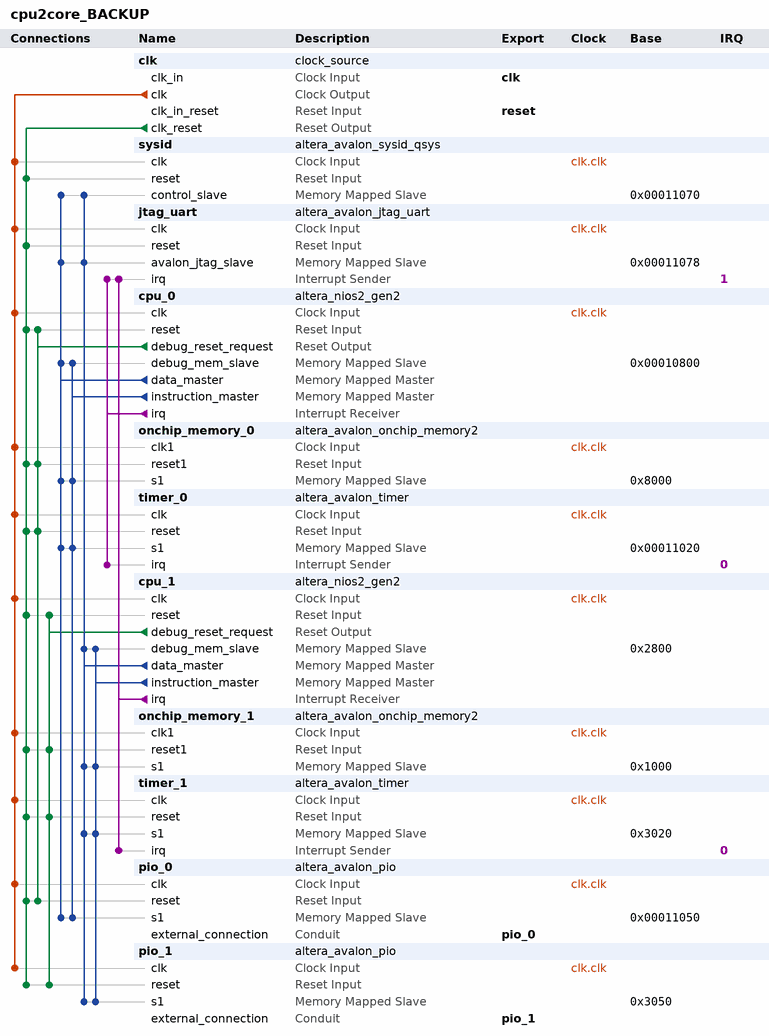
[diagram p0: system contents]
# Platform Designer (Qsys) system cpu2core_BACKUP, MAX 10 10M08SAE144C8GES
# Parameters at their usual value, and those the tool derives, are not listed.
package require -exact qsys 14.1
create_system cpu2core_BACKUP
set_project_property DEVICE_FAMILY {MAX 10}
set_project_property DEVICE 10M08SAE144C8GES

add_instance clk clock_source 14.1
set_instance_parameter_value clk clockFrequency 50000000

add_instance sysid altera_avalon_sysid_qsys 14.1
set_instance_parameter_value sysid id 0

add_instance jtag_uart altera_avalon_jtag_uart 14.1
set_instance_parameter_value jtag_uart simInteractiveOptions NO_INTERACTIVE_WINDOWS

add_instance cpu_0 altera_nios2_gen2 14.1
set_instance_parameter_value cpu_0 dcache_size 2048
set_instance_parameter_value cpu_0 exceptionSlave onchip_memory_0.s1
set_instance_parameter_value cpu_0 icache_size 4096
set_instance_parameter_value cpu_0 impl Tiny
set_instance_parameter_value cpu_0 resetSlave onchip_memory_0.s1

add_instance onchip_memory_0 altera_avalon_onchip_memory2 14.1
set_instance_parameter_value onchip_memory_0 dataWidth 32
set_instance_parameter_value onchip_memory_0 dualPort false
set_instance_parameter_value onchip_memory_0 initMemContent true
set_instance_parameter_value onchip_memory_0 initializationFileName onchip_mem.hex
set_instance_parameter_value onchip_memory_0 memorySize 25600

add_instance timer_0 altera_avalon_timer 14.1
set_instance_parameter_value timer_0 alwaysRun true
set_instance_parameter_value timer_0 fixedPeriod true
set_instance_parameter_value timer_0 period 1
set_instance_parameter_value timer_0 periodUnits USEC
set_instance_parameter_value timer_0 snapshot false

add_instance cpu_1 altera_nios2_gen2 14.1
set_instance_parameter_value cpu_1 dcache_size 2048
set_instance_parameter_value cpu_1 exceptionSlave onchip_memory_1.s1
set_instance_parameter_value cpu_1 icache_size 4096
set_instance_parameter_value cpu_1 impl Tiny
set_instance_parameter_value cpu_1 resetSlave onchip_memory_1.s1

add_instance onchip_memory_1 altera_avalon_onchip_memory2 14.1
set_instance_parameter_value onchip_memory_1 dataWidth 32
set_instance_parameter_value onchip_memory_1 dualPort false
set_instance_parameter_value onchip_memory_1 initMemContent true
set_instance_parameter_value onchip_memory_1 initializationFileName onchip_mem.hex
set_instance_parameter_value onchip_memory_1 memorySize 4096

add_instance timer_1 altera_avalon_timer 14.1
set_instance_parameter_value timer_1 alwaysRun true
set_instance_parameter_value timer_1 fixedPeriod true
set_instance_parameter_value timer_1 period 1
set_instance_parameter_value timer_1 periodUnits USEC
set_instance_parameter_value timer_1 snapshot false

add_instance pio_0 altera_avalon_pio 14.1
set_instance_parameter_value pio_0 direction Output
set_instance_parameter_value pio_0 width 1

add_instance pio_1 altera_avalon_pio 14.1
set_instance_parameter_value pio_1 direction Output
set_instance_parameter_value pio_1 width 1

# connections
add_connection clk.clk cpu_0.clk clock
add_connection clk.clk cpu_1.clk clock
add_connection clk.clk jtag_uart.clk clock
add_connection clk.clk onchip_memory_0.clk1 clock
add_connection clk.clk onchip_memory_1.clk1 clock
add_connection clk.clk pio_0.clk clock
add_connection clk.clk pio_1.clk clock
add_connection clk.clk sysid.clk clock
add_connection clk.clk timer_0.clk clock
add_connection clk.clk timer_1.clk clock
add_connection clk.clk_reset cpu_0.reset reset
add_connection clk.clk_reset cpu_1.reset reset
add_connection clk.clk_reset jtag_uart.reset reset
add_connection clk.clk_reset onchip_memory_0.reset1 reset
add_connection clk.clk_reset onchip_memory_1.reset1 reset
add_connection clk.clk_reset pio_0.reset reset
add_connection clk.clk_reset pio_1.reset reset
add_connection clk.clk_reset sysid.reset reset
add_connection clk.clk_reset timer_0.reset reset
add_connection clk.clk_reset timer_1.reset reset
add_connection cpu_0.debug_reset_request cpu_0.reset reset
add_connection cpu_0.debug_reset_request onchip_memory_0.reset1 reset
add_connection cpu_0.debug_reset_request pio_0.reset reset
add_connection cpu_0.debug_reset_request timer_0.reset reset
add_connection cpu_1.debug_reset_request cpu_1.reset reset
add_connection cpu_1.debug_reset_request onchip_memory_1.reset1 reset
add_connection cpu_1.debug_reset_request pio_1.reset reset
add_connection cpu_1.debug_reset_request timer_1.reset reset
add_connection cpu_0.data_master cpu_0.debug_mem_slave avalon
set_connection_parameter_value cpu_0.data_master/cpu_0.debug_mem_slave baseAddress 0x00010800
add_connection cpu_0.data_master jtag_uart.avalon_jtag_slave avalon
set_connection_parameter_value cpu_0.data_master/jtag_uart.avalon_jtag_slave baseAddress 0x00011078
add_connection cpu_0.data_master onchip_memory_0.s1 avalon
set_connection_parameter_value cpu_0.data_master/onchip_memory_0.s1 baseAddress 0x8000
add_connection cpu_0.data_master pio_0.s1 avalon
set_connection_parameter_value cpu_0.data_master/pio_0.s1 baseAddress 0x00011050
add_connection cpu_0.data_master sysid.control_slave avalon
set_connection_parameter_value cpu_0.data_master/sysid.control_slave baseAddress 0x00011070
add_connection cpu_0.data_master timer_0.s1 avalon
set_connection_parameter_value cpu_0.data_master/timer_0.s1 baseAddress 0x00011020
add_connection cpu_0.instruction_master cpu_0.debug_mem_slave avalon
set_connection_parameter_value cpu_0.instruction_master/cpu_0.debug_mem_slave baseAddress 0x00010800
add_connection cpu_0.instruction_master onchip_memory_0.s1 avalon
set_connection_parameter_value cpu_0.instruction_master/onchip_memory_0.s1 baseAddress 0x8000
add_connection cpu_0.instruction_master pio_0.s1 avalon
set_connection_parameter_value cpu_0.instruction_master/pio_0.s1 baseAddress 0x00011050
add_connection cpu_0.instruction_master timer_0.s1 avalon
set_connection_parameter_value cpu_0.instruction_master/timer_0.s1 baseAddress 0x00011020
add_connection cpu_1.data_master cpu_1.debug_mem_slave avalon
set_connection_parameter_value cpu_1.data_master/cpu_1.debug_mem_slave baseAddress 0x2800
add_connection cpu_1.data_master jtag_uart.avalon_jtag_slave avalon
set_connection_parameter_value cpu_1.data_master/jtag_uart.avalon_jtag_slave baseAddress 0x00011078
add_connection cpu_1.data_master onchip_memory_1.s1 avalon
set_connection_parameter_value cpu_1.data_master/onchip_memory_1.s1 baseAddress 0x1000
add_connection cpu_1.data_master pio_1.s1 avalon
set_connection_parameter_value cpu_1.data_master/pio_1.s1 baseAddress 0x3050
add_connection cpu_1.data_master sysid.control_slave avalon
set_connection_parameter_value cpu_1.data_master/sysid.control_slave baseAddress 0x00011070
add_connection cpu_1.data_master timer_1.s1 avalon
set_connection_parameter_value cpu_1.data_master/timer_1.s1 baseAddress 0x3020
add_connection cpu_1.instruction_master cpu_1.debug_mem_slave avalon
set_connection_parameter_value cpu_1.instruction_master/cpu_1.debug_mem_slave baseAddress 0x2800
add_connection cpu_1.instruction_master onchip_memory_1.s1 avalon
set_connection_parameter_value cpu_1.instruction_master/onchip_memory_1.s1 baseAddress 0x1000
add_connection cpu_1.instruction_master pio_1.s1 avalon
set_connection_parameter_value cpu_1.instruction_master/pio_1.s1 baseAddress 0x3050
add_connection cpu_1.instruction_master timer_1.s1 avalon
set_connection_parameter_value cpu_1.instruction_master/timer_1.s1 baseAddress 0x3020
add_connection cpu_0.irq jtag_uart.irq interrupt
set_connection_parameter_value cpu_0.irq/jtag_uart.irq irqNumber 1
add_connection cpu_0.irq timer_0.irq interrupt
set_connection_parameter_value cpu_0.irq/timer_0.irq irqNumber 0
add_connection cpu_1.irq jtag_uart.irq interrupt
set_connection_parameter_value cpu_1.irq/jtag_uart.irq irqNumber 1
add_connection cpu_1.irq timer_1.irq interrupt
set_connection_parameter_value cpu_1.irq/timer_1.irq irqNumber 0

# exported interfaces
add_interface clk clock sink
set_interface_property clk EXPORT_OF clk.clk_in
add_interface pio_0 conduit end
set_interface_property pio_0 EXPORT_OF pio_0.external_connection
add_interface pio_1 conduit end
set_interface_property pio_1 EXPORT_OF pio_1.external_connection
add_interface reset reset sink
set_interface_property reset EXPORT_OF clk.clk_in_reset

set_interconnect_requirement {$system} qsys_mm.clockCrossingAdapter HANDSHAKE
set_interconnect_requirement {$system} qsys_mm.insertDefaultSlave FALSE
set_interconnect_requirement {$system} qsys_mm.maxAdditionalLatency 1

save_system cpu2core_BACKUP.qsys
